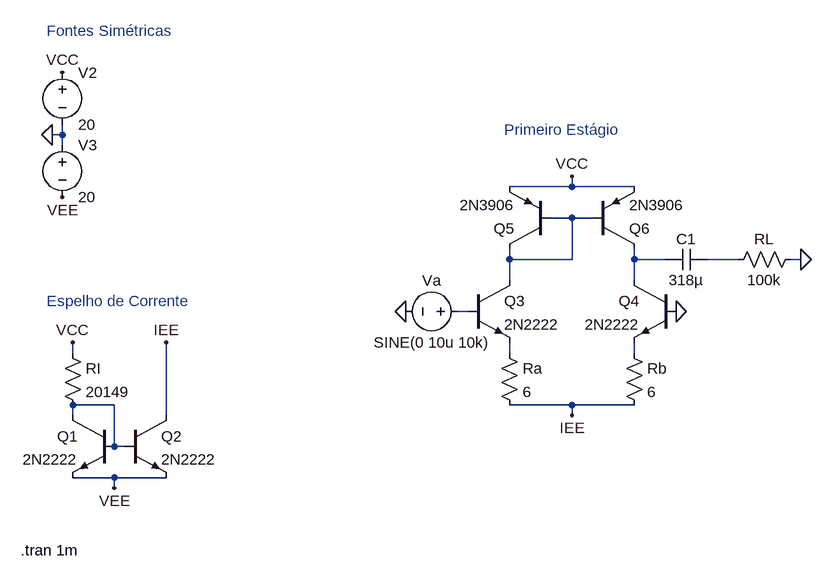
[diagram p0: schematic Draft1.asc]
Draft1.asc, the LTspice schematic file:
Version 4
SHEET 1 1140 680
WIRE -16 -272 -16 -288
WIRE -16 -272 -32 -272
WIRE -16 -256 -16 -272
WIRE 768 -192 768 -208
WIRE 768 -192 672 -192
WIRE 864 -192 768 -192
WIRE 768 -144 736 -144
WIRE 800 -144 768 -144
WIRE 672 -80 672 -96
WIRE 768 -80 768 -144
WIRE 768 -80 672 -80
WIRE 864 -80 864 -96
WIRE 912 -80 864 -80
WIRE 1024 -80 976 -80
WIRE 1120 -80 1104 -80
WIRE 672 -48 672 -80
WIRE 864 -48 864 -80
WIRE 608 0 592 0
WIRE 0 64 0 48
WIRE 672 64 672 48
WIRE 864 64 864 48
WIRE 64 144 0 144
WIRE 768 144 672 144
WIRE 864 144 768 144
WIRE 0 160 0 144
WIRE 144 160 144 48
WIRE 768 160 768 144
WIRE 64 208 64 144
WIRE 80 208 64 208
WIRE 64 256 0 256
WIRE 144 256 64 256
WIRE 64 272 64 256
FLAG 0 48 VCC
FLAG 64 272 VEE
FLAG 144 48 IEE
FLAG 512 0 0
FLAG 928 0 0
FLAG 768 -208 VCC
FLAG 1120 -80 0
FLAG -16 -368 VCC
FLAG -16 -176 VEE
FLAG 768 160 IEE
FLAG -32 -272 0
SYMBOL res -16 48 R0
SYMATTR InstName RI
SYMATTR Value 20149
SYMBOL npn 64 160 M0
SYMATTR InstName Q1
SYMATTR Value 2N2222
SYMBOL npn 80 160 R0
SYMATTR InstName Q2
SYMATTR Value 2N2222
SYMBOL npn 608 -48 R0
SYMATTR InstName Q3
SYMATTR Value 2N2222
SYMBOL npn 928 -48 M0
SYMATTR InstName Q4
SYMATTR Value 2N2222
SYMBOL pnp 736 -96 R180
SYMATTR InstName Q5
SYMATTR Value 2N3906
SYMBOL pnp 800 -96 M180
SYMATTR InstName Q6
SYMATTR Value 2N3906
SYMBOL voltage 608 0 R90
WINDOW 0 -32 56 VBottom 2
WINDOW 3 32 56 VTop 2
WINDOW 123 0 0 Left 0
WINDOW 39 0 0 Left 0
SYMATTR InstName Va
SYMATTR Value SINE(0 10u 10k)
SYMBOL cap 976 -96 R90
WINDOW 0 0 32 VBottom 2
WINDOW 3 32 32 VTop 2
SYMATTR InstName C1
SYMATTR Value 318µ
SYMBOL res 1120 -96 R90
WINDOW 0 0 56 VBottom 2
WINDOW 3 32 56 VTop 2
SYMATTR InstName RL
SYMATTR Value 100k
SYMBOL voltage -16 -384 R0
WINDOW 123 0 0 Left 0
WINDOW 39 0 0 Left 0
SYMATTR InstName V2
SYMATTR Value 20
SYMBOL voltage -16 -272 R0
WINDOW 123 0 0 Left 0
WINDOW 39 0 0 Left 0
SYMATTR InstName V3
SYMATTR Value 20
SYMBOL res 656 48 R0
SYMATTR InstName Ra
SYMATTR Value 6
SYMBOL res 848 48 R0
SYMATTR InstName Rb
SYMATTR Value 6
TEXT -40 -432 Left 2 ;Fontes Simétricas
TEXT -40 -16 Left 2 ;Espelho de Corrente
TEXT 664 -280 Left 2 ;Primeiro Estágio
TEXT -80 368 Left 2 !.tran 1m

The netlist it stands for:
* Draft1.asc
RI VCC N007 20149
Q1 N007 N007 VEE 0 2N2222
Q2 IEE N007 VEE 0 2N2222
Q3 N001 N004 N005 0 2N2222
Q4 N002 0 N006 0 2N2222
Q5 N001 N001 VCC 0 2N3906
Q6 N002 N001 VCC 0 2N3906
Va N004 0 SINE(0 10u 10k)
C1 N003 N002 318µ
RL 0 N003 100k
V2 VCC 0 20
V3 0 VEE 20
Ra N005 IEE 6
Rb N006 IEE 6
.model NPN NPN
.model PNP PNP
.lib standard.bjt
* Fontes Simétricas
* Espelho de Corrente
* Primeiro Estágio
.tran 1m
.backanno
.end